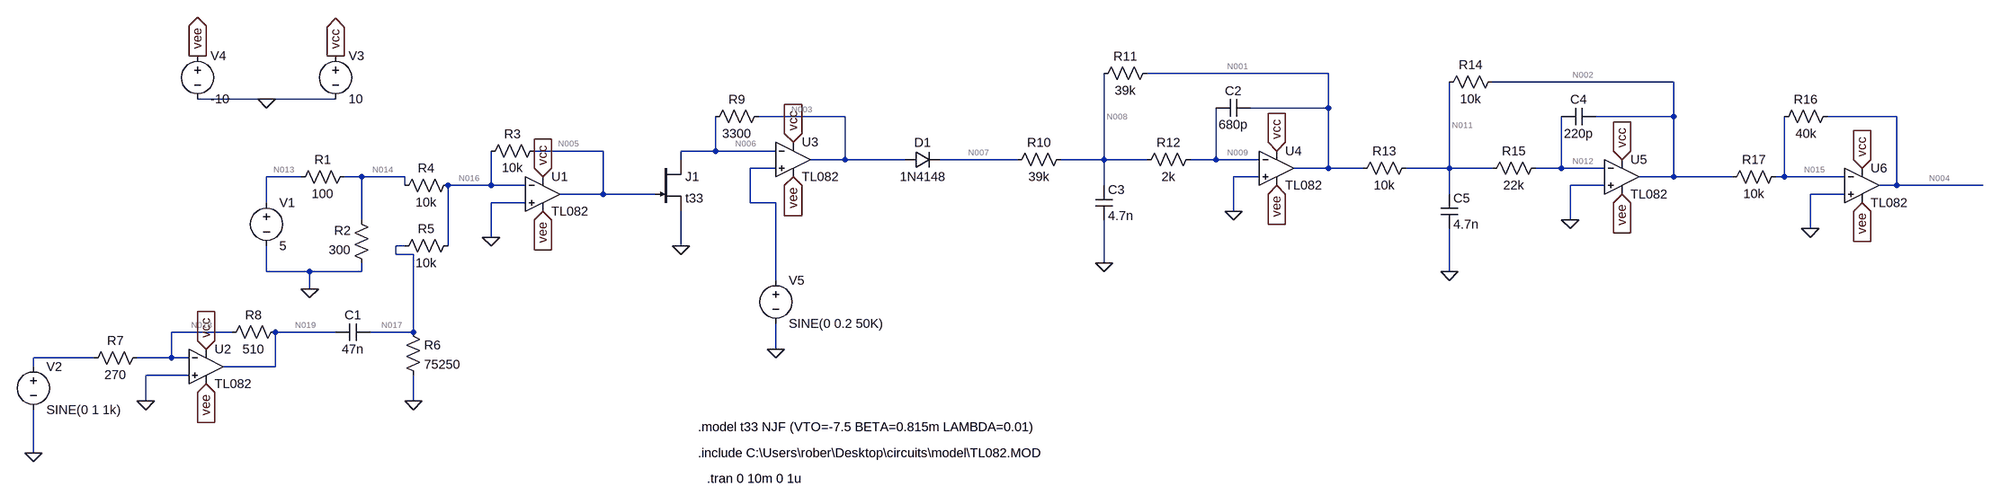
[diagram p0: schematic modulationAMExpMinh.asc]
modulationAMExpMinh.asc, the LTspice schematic file:
Version 4.1
SHEET 1 3504 724
WIRE 2112 -64 1776 -64
WIRE 2752 -48 2416 -48
WIRE 144 -16 16 -16
WIRE 272 -16 144 -16
WIRE 2112 0 2112 -64
WIRE 2112 0 1968 0
WIRE 1216 16 1056 16
WIRE 2752 16 2752 -48
WIRE 2752 16 2608 16
WIRE 3280 16 3152 16
WIRE 768 80 640 80
WIRE 976 80 976 16
WIRE 976 80 912 80
WIRE 1088 80 976 80
WIRE 912 96 912 80
WIRE 1216 96 1216 16
WIRE 1216 96 1152 96
WIRE 1328 96 1216 96
WIRE 1536 96 1392 96
WIRE 1696 96 1696 -64
WIRE 1696 96 1616 96
WIRE 1776 96 1696 96
WIRE 1904 96 1904 0
WIRE 1904 96 1856 96
WIRE 1984 96 1904 96
WIRE 1088 112 1040 112
WIRE 2112 112 2112 0
WIRE 2112 112 2048 112
WIRE 2176 112 2112 112
WIRE 2336 112 2336 -48
WIRE 2336 112 2256 112
WIRE 2416 112 2336 112
WIRE 2544 112 2544 16
WIRE 2544 112 2496 112
WIRE 2624 112 2544 112
WIRE 208 128 144 128
WIRE 320 128 288 128
WIRE 400 128 320 128
WIRE 1984 128 1936 128
WIRE 2752 128 2752 16
WIRE 2752 128 2688 128
WIRE 2976 128 2752 128
WIRE 3072 128 3072 16
WIRE 3072 128 3056 128
WIRE 3184 128 3072 128
WIRE 400 144 400 128
WIRE 560 144 560 80
WIRE 560 144 480 144
WIRE 624 144 560 144
WIRE 1696 144 1696 96
WIRE 2624 144 2560 144
WIRE 3280 144 3280 16
WIRE 3280 144 3248 144
WIRE 3440 144 3280 144
WIRE 768 160 768 80
WIRE 768 160 688 160
WIRE 864 160 768 160
WIRE 2336 160 2336 112
WIRE 3184 160 3120 160
WIRE 144 176 144 128
WIRE 624 176 560 176
WIRE 1040 176 1040 112
WIRE 1088 176 1040 176
WIRE 1936 192 1936 128
WIRE 320 208 320 128
WIRE 2560 208 2560 144
WIRE 3120 224 3120 160
WIRE 560 240 560 176
WIRE 400 256 384 256
WIRE 480 256 480 144
WIRE 912 256 912 192
WIRE 384 272 384 256
WIRE 416 272 384 272
WIRE 1696 288 1696 208
WIRE 144 304 144 256
WIRE 224 304 144 304
WIRE 320 304 320 288
WIRE 320 304 224 304
WIRE 2336 304 2336 224
WIRE 1088 320 1088 176
WIRE 224 336 224 304
WIRE 80 416 -32 416
WIRE 272 416 160 416
WIRE 416 416 416 272
WIRE 416 416 336 416
WIRE 1088 448 1088 400
WIRE -176 464 -288 464
WIRE -32 464 -32 416
WIRE -32 464 -96 464
WIRE 0 464 -32 464
WIRE -288 480 -288 464
WIRE 160 480 160 416
WIRE 160 480 64 480
WIRE 0 496 -80 496
WIRE -80 544 -80 496
WIRE 416 544 416 496
WIRE -288 640 -288 560
FLAG 560 240 0
FLAG -288 640 0
FLAG 144 -16 0
FLAG 16 -96 vee
IOPIN 16 -96 Out
FLAG 272 -96 vcc
IOPIN 272 -96 Out
FLAG 224 336 0
FLAG 32 448 vcc
IOPIN 32 448 In
FLAG 32 512 vee
IOPIN 32 512 In
FLAG 656 128 vcc
IOPIN 656 128 In
FLAG 656 192 vee
IOPIN 656 192 In
FLAG -80 544 0
FLAG 416 544 0
FLAG 912 256 0
FLAG 1120 64 vcc
IOPIN 1120 64 In
FLAG 1120 128 vee
IOPIN 1120 128 In
FLAG 1088 448 0
FLAG 2016 80 vcc
IOPIN 2016 80 In
FLAG 2016 144 vee
IOPIN 2016 144 In
FLAG 1696 288 0
FLAG 2656 96 vcc
IOPIN 2656 96 In
FLAG 2656 160 vee
IOPIN 2656 160 In
FLAG 2336 304 0
FLAG 1936 192 0
FLAG 2560 208 0
FLAG 3216 112 vcc
IOPIN 3216 112 In
FLAG 3216 176 vee
IOPIN 3216 176 In
FLAG 3120 224 0
DATAFLAG 3408 144 ""
SYMBOL voltage 144 160 R0
WINDOW 123 0 0 Left 0
WINDOW 39 0 0 Left 0
SYMATTR InstName V1
SYMATTR Value 5
SYMBOL voltage -288 464 R0
WINDOW 123 0 0 Left 0
WINDOW 39 0 0 Left 0
SYMATTR InstName V2
SYMATTR Value SINE(0 1 1k)
SYMBOL voltage 272 -112 R0
WINDOW 123 0 0 Left 0
WINDOW 39 0 0 Left 0
SYMATTR InstName V3
SYMATTR Value 10
SYMBOL res 304 112 R90
WINDOW 0 0 56 VBottom 2
WINDOW 3 32 56 VTop 2
SYMATTR InstName R1
SYMATTR Value 100
SYMBOL res 336 304 R180
WINDOW 0 36 76 Left 2
WINDOW 3 36 40 Left 2
SYMATTR InstName R2
SYMATTR Value 300
SYMBOL OpAmps\\opamp2 656 96 R0
SYMATTR InstName U1
SYMATTR Value TL082
SYMBOL res 656 64 R90
WINDOW 0 0 56 VBottom 2
WINDOW 3 32 56 VTop 2
SYMATTR InstName R3
SYMATTR Value 10k
SYMBOL voltage 16 -112 R0
SYMATTR InstName V4
SYMATTR Value -10
SYMBOL res 496 128 R90
WINDOW 0 0 56 VBottom 2
WINDOW 3 32 56 VTop 2
SYMATTR InstName R4
SYMATTR Value 10k
SYMBOL res 496 240 R90
WINDOW 0 0 56 VBottom 2
WINDOW 3 32 56 VTop 2
SYMATTR InstName R5
SYMATTR Value 10k
SYMBOL OpAmps\\opamp2 32 416 R0
SYMATTR InstName U2
SYMATTR Value TL082
SYMBOL res 400 400 R0
SYMATTR InstName R6
SYMATTR Value 75250
SYMBOL cap 336 400 R90
WINDOW 0 0 32 VBottom 2
WINDOW 3 32 32 VTop 2
SYMATTR InstName C1
SYMATTR Value 47n
SYMBOL res -80 448 R90
WINDOW 0 0 56 VBottom 2
WINDOW 3 32 56 VTop 2
SYMATTR InstName R7
SYMATTR Value 270
SYMBOL res 176 400 R90
WINDOW 0 0 56 VBottom 2
WINDOW 3 32 56 VTop 2
SYMATTR InstName R8
SYMATTR Value 510
SYMBOL njf 864 96 R0
SYMATTR InstName J1
SYMATTR Value t33
SYMBOL OpAmps\\opamp2 1120 32 R0
SYMATTR InstName U3
SYMATTR Value TL082
SYMBOL res 1072 0 R90
WINDOW 0 0 56 VBottom 2
WINDOW 3 32 56 VTop 2
SYMATTR InstName R9
SYMATTR Value 3300
SYMBOL voltage 1088 304 R0
WINDOW 123 0 0 Left 0
WINDOW 39 0 0 Left 0
SYMATTR InstName V5
SYMATTR Value SINE(0 0.2 50K)
SYMBOL diode 1328 112 R270
WINDOW 0 32 32 VTop 2
WINDOW 3 0 32 VBottom 2
SYMATTR InstName D1
SYMATTR Value 1N4148
SYMBOL OpAmps\\opamp2 2016 48 R0
SYMATTR InstName U4
SYMATTR Value TL082
SYMBOL res 1632 80 R90
WINDOW 0 0 56 VBottom 2
WINDOW 3 32 56 VTop 2
SYMATTR InstName R10
SYMATTR Value 39k
SYMBOL res 1792 -80 R90
WINDOW 0 0 56 VBottom 2
WINDOW 3 32 56 VTop 2
SYMATTR InstName R11
SYMATTR Value 39k
SYMBOL cap 1968 -16 R90
WINDOW 0 0 32 VBottom 2
WINDOW 3 32 32 VTop 2
SYMATTR InstName C2
SYMATTR Value 680p
SYMBOL cap 1680 144 R0
SYMATTR InstName C3
SYMATTR Value 4.7n
SYMBOL res 1872 80 R90
WINDOW 0 0 56 VBottom 2
WINDOW 3 32 56 VTop 2
SYMATTR InstName R12
SYMATTR Value 2k
SYMBOL OpAmps\\opamp2 2656 64 R0
SYMATTR InstName U5
SYMATTR Value TL082
SYMBOL res 2272 96 R90
WINDOW 0 0 56 VBottom 2
WINDOW 3 32 56 VTop 2
SYMATTR InstName R13
SYMATTR Value 10k
SYMBOL res 2432 -64 R90
WINDOW 0 0 56 VBottom 2
WINDOW 3 32 56 VTop 2
SYMATTR InstName R14
SYMATTR Value 10k
SYMBOL cap 2608 0 R90
WINDOW 0 0 32 VBottom 2
WINDOW 3 32 32 VTop 2
SYMATTR InstName C4
SYMATTR Value 220p
SYMBOL cap 2320 160 R0
SYMATTR InstName C5
SYMATTR Value 4.7n
SYMBOL res 2512 96 R90
WINDOW 0 0 56 VBottom 2
WINDOW 3 32 56 VTop 2
SYMATTR InstName R15
SYMATTR Value 22k
SYMBOL OpAmps\\opamp2 3216 80 R0
SYMATTR InstName U6
SYMATTR Value TL082
SYMBOL res 3168 0 R90
WINDOW 0 0 56 VBottom 2
WINDOW 3 32 56 VTop 2
SYMATTR InstName R16
SYMATTR Value 40k
SYMBOL res 3072 112 R90
WINDOW 0 0 56 VBottom 2
WINDOW 3 32 56 VTop 2
SYMATTR InstName R17
SYMATTR Value 10k
TEXT 944 640 Left 2 !.include C:\\Users\\rober\\Desktop\\circuits\\model\\TL082.MOD
TEXT 960 688 Left 2 !.tran 0 10m 0 1u
TEXT 944 592 Left 2 !.model t33 NJF (VTO=-7.5 BETA=0.815m LAMBDA=0.01)

The netlist it stands for:
* modulationAMExpMinh.asc
V1 N013 0 5
V2 N020 0 SINE(0 1 1k)
V3 vcc 0 10
R1 N014 N013 100
R2 0 N014 300
X§U1 0 N016 vcc vee N005 TL082  ; pins In+ In- V+ V- OUT
R3 N005 N016 10k
V4 vee 0 -10
R4 N016 N014 10k
R5 N016 N017 10k
X§U2 0 N018 vcc vee N019 TL082  ; pins In+ In- V+ V- OUT
R6 N017 0 75250
C1 N017 N019 47n
R7 N018 N020 270
R8 N019 N018 510
J1 N006 N005 0 t33
X§U3 N010 N006 vcc vee N003 TL082  ; pins In+ In- V+ V- OUT
R9 N003 N006 3300
V5 N010 0 SINE(0 0.2 50K)
D1 N003 N007 1N4148
X§U4 0 N009 vcc vee N001 TL082  ; pins In+ In- V+ V- OUT
R10 N008 N007 39k
R11 N001 N008 39k
C2 N001 N009 680p
C3 N008 0 4.7n
R12 N009 N008 2k
X§U5 0 N012 vcc vee N002 TL082  ; pins In+ In- V+ V- OUT
R13 N011 N001 10k
R14 N002 N011 10k
C4 N002 N012 220p
C5 N011 0 4.7n
R15 N012 N011 22k
X§U6 0 N015 vcc vee N004 TL082  ; pins In+ In- V+ V- OUT
R16 N004 N015 40k
R17 N015 N002 10k
.model D D
.lib standard.dio
.model NJF NJF
.model PJF PJF
.lib standard.jft
.include C:\Users\rober\Desktop\circuits\model\TL082.MOD
.tran 0 10m 0 1u
.model t33 NJF (VTO=-7.5 BETA=0.815m LAMBDA=0.01)
.backanno
.end

* Results of the author's LTspice run, read from the files saved beside the schematic
* Operating Point, zero values left out:
*   V(n001) = 12.13 µV
*   V(n002) = 11.98 µV
*   V(n003) = 234 µV
*   V(n004) = 8.555 µV
*   V(n005) = -3.722 V
*   V(n006) = 10.97 µV
*   V(n007) = 11.53 µV
*   V(n008) = 11.05 µV
*   V(n009) = 10.97 µV
*   V(n011) = 11.85 µV
*   V(n012) = 10.97 µV
*   V(n013) = 5 V
*   V(n014) = 3.722 V
*   V(n015) = 10.97 µV
*   V(n016) = 27.68 µV
*   V(n017) = 24.43 µV
*   V(n018) = 10.97 µV
*   V(n019) = 31.71 µV
*   V(vcc) = 10 V
*   V(vee) = -10 V
*   I(D1) = 12.4 pA
*   I(R1) = -12.78 mA
*   I(R10) = -12.4 pA
*   I(R11) = 27.65 pA
*   I(R12) = -40.05 pA
*   I(R13) = -27.73 pA
*   I(R14) = 12.33 pA
*   I(R15) = -40.05 pA
*   I(R16) = -60.39 pA
*   I(R17) = -100.4 pA
*   I(R2) = -12.41 mA
*   I(R3) = -372.2 µA
*   I(R4) = -372.2 µA
*   I(R5) = 324.7 pA
*   I(R6) = 324.7 pA
*   I(R7) = 40.63 nA
*   I(R8) = 40.67 nA
*   I(R9) = 67.6 nA
*   I(V1) = -12.78 mA
*   I(V2) = 40.63 nA
*   I(V3) = -57.17 mA
*   I(V4) = 57.17 mA
*   I(V5) = -40.05 pA
*   Id(J1) = 67.56 nA
*   Ig(J1) = -7.464 pA
*   Is(J1) = -67.55 nA
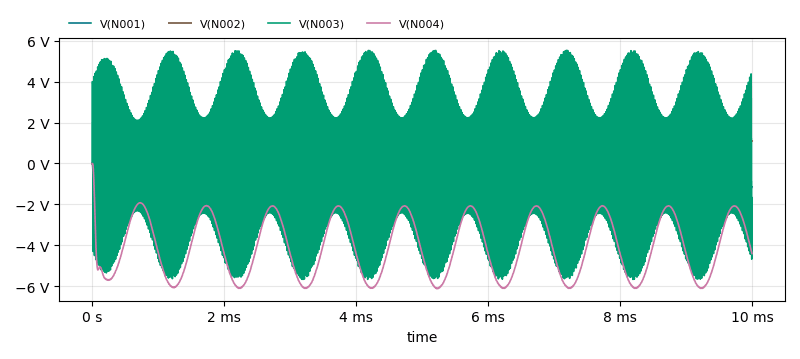
[diagram p1: Transient Analysis of modulationAMExpMinh.asc, plotted from the saved traces]
* Transient Analysis, 1 run:
*   V(N001): min -1.608 V, max 12.26 µV, average -1.024 V, rms 1.084 V, last -1.14 V
*   V(N002): min 11.98 µV, max 1.531 V, average 1.023 V, rms 1.084 V, last 1.101 V
*   V(N003): min -5.668 V, max 5.527 V, average -48.61 mV, rms 2.938 V, last -1.672 V
*   V(N004): min -6.123 V, max 8.555 µV, average -4.091 V, rms 4.334 V, last -4.402 V